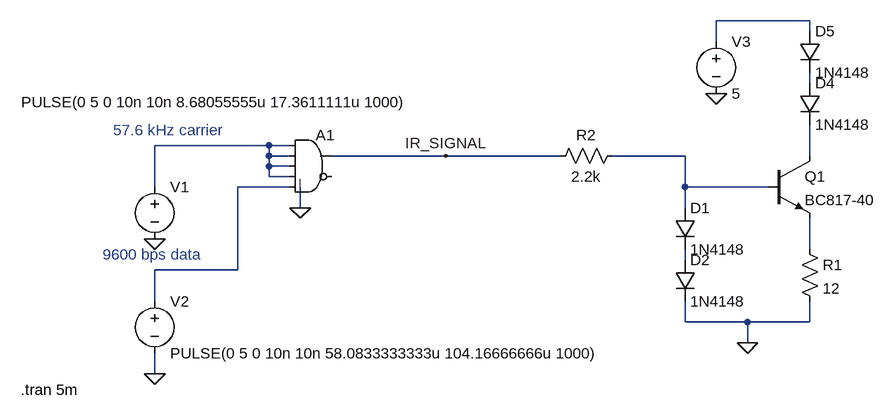
[diagram p0: schematic Transmisor.asc]
Transmisor.asc, the LTspice schematic file:
Version 4
SHEET 1 1044 680
WIRE 928 -144 784 -144
WIRE 928 -128 928 -144
WIRE 784 -112 784 -144
WIRE 928 -48 928 -64
WIRE 96 48 -80 48
WIRE 128 48 96 48
WIRE 96 64 96 48
WIRE 128 64 96 64
WIRE 368 64 192 64
WIRE 544 64 368 64
WIRE 736 64 624 64
WIRE 928 64 928 16
WIRE 96 80 96 64
WIRE 128 80 96 80
WIRE 96 96 96 80
WIRE 128 96 96 96
WIRE -80 112 -80 48
WIRE 128 112 48 112
WIRE 736 112 736 64
WIRE 864 112 736 112
WIRE 144 144 144 112
WIRE 736 144 736 112
WIRE 928 208 928 160
WIRE 736 224 736 208
WIRE 48 240 48 112
WIRE 48 240 -80 240
WIRE -80 288 -80 240
WIRE 736 320 736 288
WIRE 832 320 736 320
WIRE 928 320 928 288
WIRE 928 320 832 320
WIRE 832 352 832 320
WIRE -80 400 -80 368
FLAG 144 144 0
FLAG -80 192 0
FLAG -80 400 0
FLAG 368 64 IR_SIGNAL
FLAG 832 352 0
FLAG 784 -32 0
SYMBOL Digital\\and 160 16 R0
WINDOW 3 0 0 Invisible 2
SYMATTR InstName A1
SYMATTR Value Vhigh=5 Vlow=0 Ref=1.5 Trise=5n Tfall=5n Td=5n
SYMBOL voltage -80 96 R0
WINDOW 3 -205 -115 Left 2
WINDOW 123 0 0 Left 2
WINDOW 39 0 0 Left 2
SYMATTR InstName V1
SYMATTR Value PULSE(0 5 0 10n 10n 8.68055555u 17.3611111u 1000)
SYMBOL voltage -80 272 R0
WINDOW 123 0 0 Left 2
WINDOW 39 0 0 Left 2
SYMATTR InstName V2
SYMATTR Value PULSE(0 5 0 10n 10n 58.0833333333u 104.16666666u 1000)
SYMBOL npn 864 64 R0
SYMATTR InstName Q1
SYMATTR Value BC817-40
SYMBOL diode 720 144 R0
SYMATTR InstName D1
SYMATTR Value 1N4148
SYMBOL diode 720 224 R0
SYMATTR InstName D2
SYMATTR Value 1N4148
SYMBOL res 912 192 R0
SYMATTR InstName R1
SYMATTR Value 12
SYMBOL res 640 48 R90
WINDOW 0 0 56 VBottom 2
WINDOW 3 32 56 VTop 2
SYMATTR InstName R2
SYMATTR Value 2.2k
SYMBOL diode 912 -48 R0
SYMATTR InstName D4
SYMATTR Value 1N4148
SYMBOL diode 912 -128 R0
SYMATTR InstName D5
SYMATTR Value 1N4148
SYMBOL voltage 784 -128 R0
WINDOW 123 0 0 Left 2
WINDOW 39 0 0 Left 2
SYMATTR InstName V3
SYMATTR Value 5
TEXT -144 24 Left 2 ;57.6 kHz carrier
TEXT -286 424 Left 2 !.tran 5m
TEXT -160 216 Left 2 ;9600 bps data

The netlist it stands for:
* Transmisor.asc
A1 N003 N003 N003 N003 N006 0 IR_SIGNAL 0 AND Vhigh=5 Vlow=0 Ref=1.5 Trise=5n Tfall=5n Td=5n
V1 N003 0 PULSE(0 5 0 10n 10n 8.68055555u 17.3611111u 1000)
V2 N006 0 PULSE(0 5 0 10n 10n 58.0833333333u 104.16666666u 1000)
Q1 N005 N004 N007 0 BC817-40
D1 N004 N008 1N4148
D2 N008 0 1N4148
R1 N007 0 12
R2 N004 IR_SIGNAL 2.2k
D4 N002 N005 1N4148
D5 N001 N002 1N4148
V3 N001 0 5
.model D D
.lib standard.dio
.model NPN NPN
.model PNP PNP
.lib standard.bjt
* 57.6 kHz carrier
.tran 5m
* 9600 bps data
.backanno
.end